# Altium schematic sheet Input_dig.SchDoc
size A4; DocumentNumber: 3; SheetNumber: 3; SheetTotal: 11
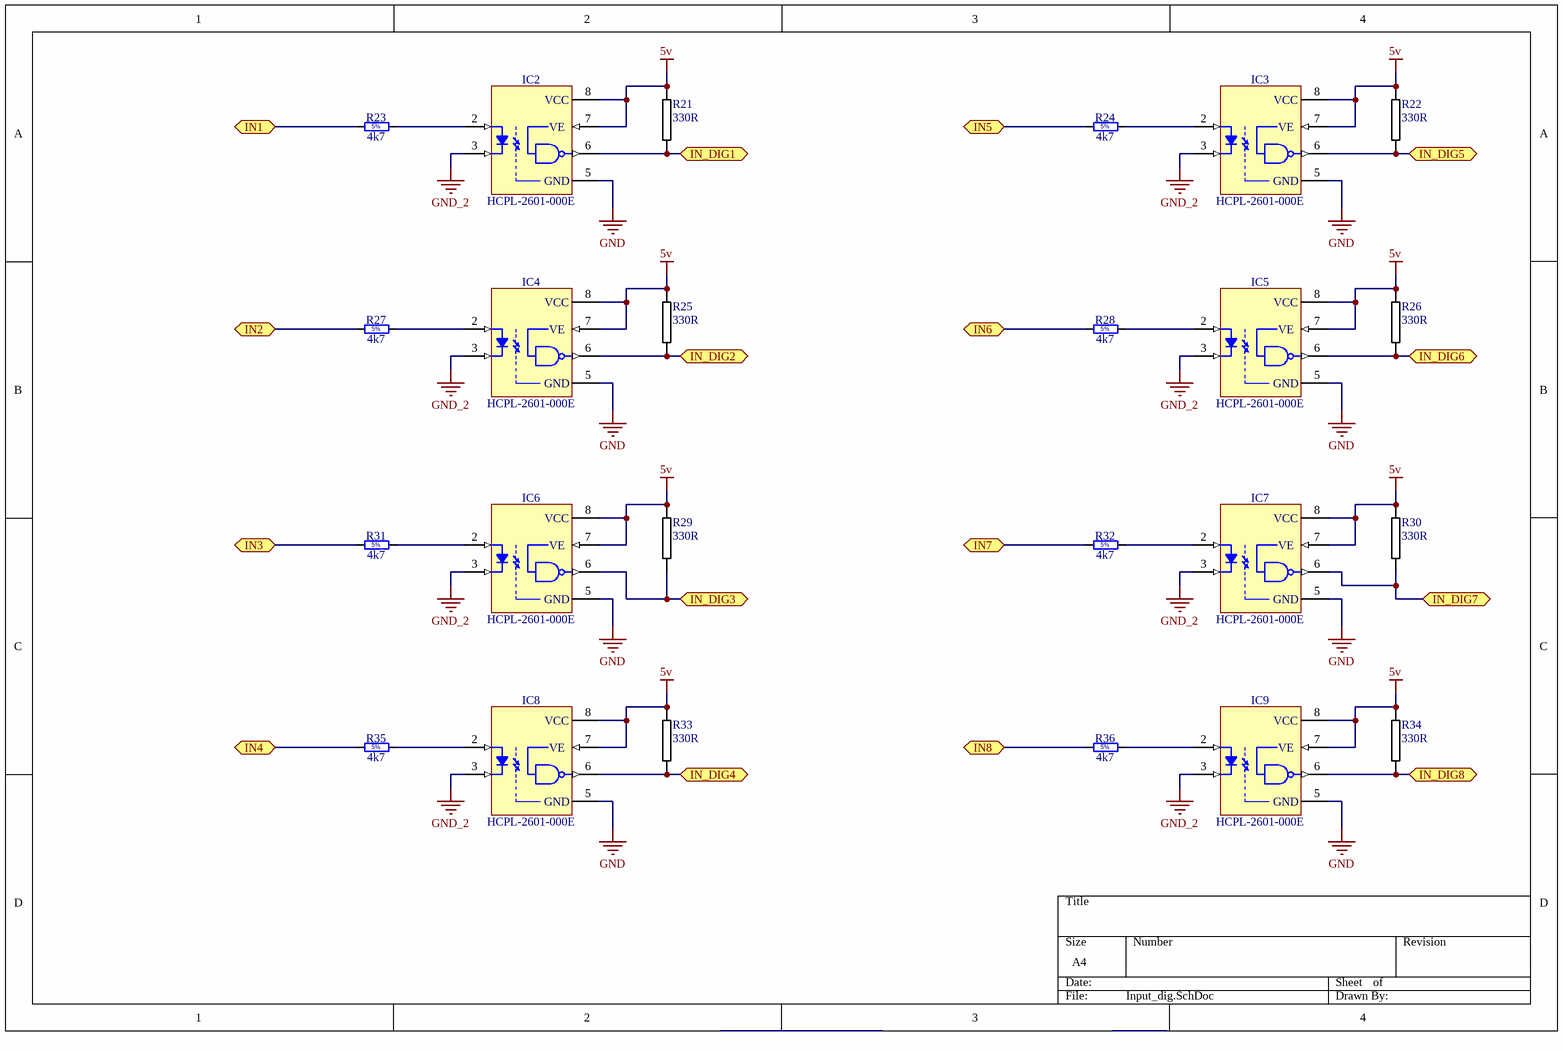
[diagram p0: Input_dig.SchDoc]

## Parts
IC2  HCPL-2601-000E  [DIP8-300]
IC3  HCPL-2601-000E  [DIP8-300]
IC4  HCPL-2601-000E  [DIP8-300]
IC5  HCPL-2601-000E  [DIP8-300]
IC6  HCPL-2601-000E  [DIP8-300]
IC7  HCPL-2601-000E  [DIP8-300]
IC8  HCPL-2601-000E  [DIP8-300]
IC9  HCPL-2601-000E  [DIP8-300]
R21  330R  [0805R-330]
R22  330R  [0805R-330]
R23  4k7  [RES2286-1670X520]
R24  4k7  [RES2286-1670X520]
R25  330R  [0805R-330]
R26  330R  [0805R-330]
R27  4k7  [RES2286-1670X520]
R28  4k7  [RES2286-1670X520]
R29  330R  [0805R-330]
R30  330R  [0805R-330]
R31  4k7  [RES2286-1670X520]
R32  4k7  [RES2286-1670X520]
R33  330R  [0805R-330]
R34  330R  [0805R-330]
R35  4k7  [RES2286-1670X520]
R36  4k7  [RES2286-1670X520]

## Ports
IN1, IN2, IN3, IN4, IN5, IN6, IN7, IN8, IN_DIG1, IN_DIG2, IN_DIG3, IN_DIG4, IN_DIG5, IN_DIG6, IN_DIG7, IN_DIG8

## Nets
5v: IC2.7(VE) IC2.8(VCC) IC3.7(VE) IC3.8(VCC) IC4.7(VE) IC4.8(VCC) IC5.7(VE) IC5.8(VCC) IC6.7(VE) IC6.8(VCC) IC7.7(VE) IC7.8(VCC) IC8.7(VE) IC8.8(VCC) IC9.7(VE) IC9.8(VCC) R21.1 R22.1 R25.1 R26.1 R29.1 R30.1 R33.1 R34.1
GND: IC2.5(GND) IC3.5(GND) IC4.5(GND) IC5.5(GND) IC6.5(GND) IC7.5(GND) IC8.5(GND) IC9.5(GND)
GND_2: IC2.3(K) IC3.3(K) IC4.3(K) IC5.3(K) IC6.3(K) IC7.3(K) IC8.3(K) IC9.3(K)
IN1: R23.1 ; port IN1
IN2: R27.1 ; port IN2
IN3: R31.1 ; port IN3
IN4: R35.1 ; port IN4
IN5: R24.1 ; port IN5
IN6: R28.1 ; port IN6
IN7: R32.1 ; port IN7
IN8: R36.1 ; port IN8
IN_DIG1: IC2.6(VO) R21.2 ; port IN_DIG1
IN_DIG2: IC4.6(VO) R25.2 ; port IN_DIG2
IN_DIG3: IC6.6(VO) R29.2 ; port IN_DIG3
IN_DIG4: IC8.6(VO) R33.2 ; port IN_DIG4
IN_DIG5: IC3.6(VO) R22.2 ; port IN_DIG5
IN_DIG6: IC5.6(VO) R26.2 ; port IN_DIG6
IN_DIG7: IC7.6(VO) R30.2 ; port IN_DIG7
IN_DIG8: IC9.6(VO) R34.2 ; port IN_DIG8
NetIC2_2: IC2.2(A) R23.2
NetIC3_2: IC3.2(A) R24.2
NetIC4_2: IC4.2(A) R27.2
NetIC5_2: IC5.2(A) R28.2
NetIC6_2: IC6.2(A) R31.2
NetIC7_2: IC7.2(A) R32.2
NetIC8_2: IC8.2(A) R35.2
NetIC9_2: IC9.2(A) R36.2

## Notes on the sheet
- (in symbol RMF_4K7_5%_3W_250PPM_2286-1670X520) 5%

## Library data of the parts
IC2-IC9 = HCPL-2601-000E: Single Optocoupler; Part Description: High CMR, High Speed TTL Compatible Optocouplers; Manufacturer: AVAGO TECHNOLOGIES; Table: Optocouplers; Part Number: HCPL-2601-000E; Component Kind: Standard; Component Type: Standard; Device: HCPL-2601-000E; PackageDescription: DIP; 8 Leads; Row Spacing 7.62 mm; Pitch 2.54 mm; Manufacturer Part Number: HCPL-2601-000E; Pin Count: 8; Case: DIP8-300; Mounted: Yes; Socket: Yes; SMD: No; ComponentHeight: 4.7mm; HelpURL: \\cern.ch\dfs\Applications\Altium\Datasheets\HCPL-2601-000E.pdf; Author: CERN DEM JLC; CreateDate: 30/03/2009; LatestRevisionDate: 30/03/2009
R21 R22 R25 R26 R29 R30 R33 R34 = 0805R-330: RESISTOR 0805 1/4 WATT THIN FILM; Reel: *
R23 R24 R27 R28 R31 R32 R35 R36 = RMF_4K7_5%_3W_250PPM_2286-1670X520: Resistor - 5%; Part Description: Leaded Power Metal Film Resistor; Manufacturer: GENERIC; Manufacturer1 Part Number: PR03000204701JAC00; Power: 3W; TC: ±250ppm/°C; Table: Resistors THD; Part Number: RMF_4K7_5%_3W_250PPM_2286-1670X520; Component Kind: Standard; Component Type: Standard; Pin Count: 2; Value: 4k7; Status: Preferred; Tolerance: ±5%; Manufacturer Part Number: RMF_4K7_5%_3W_250PPM_2286-1670X520; Case: LS22.86 L16.7 x D5.2; Mounted: Yes; Socket: No; SMD: No; ComponentHeight: 5.2mm; Manufacturer1 Example: VISHAY BCCOMPONENT; Manufacturer1 ComponentHeight: 5.2mm; HelpURL: \\cern.ch\dfs\Applications\Altium\Datasheets\RMF_VISHAY_PR03.pdf; Author: CERN DEM JLC; CreateDate: 19/06/2008; LatestRevisionDate: 01/10/2012